# EAGLE schematic MO-v2-5_MOD-Strips (EAGLE 8.3.2)
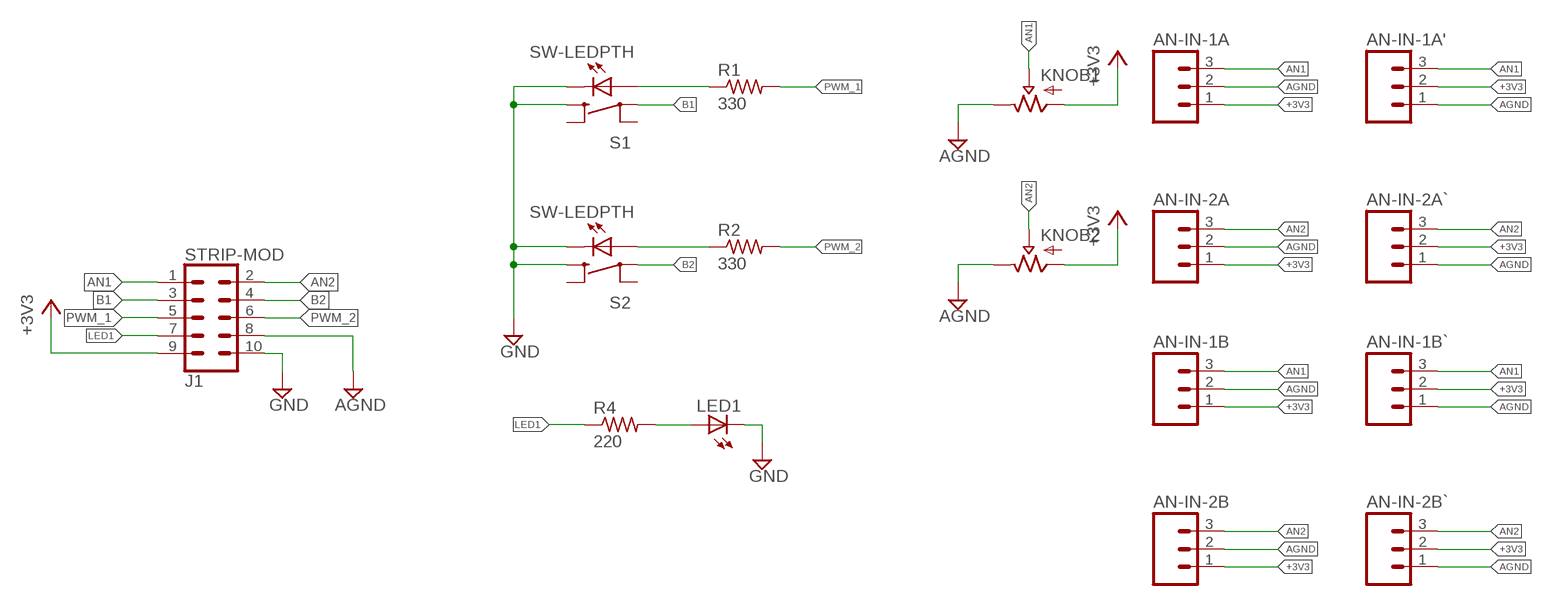
[diagram p0: schematic, sheet 1]

## Parts
AN-IN-1A  M031X03_NO_SILK  [1X03_NO_SILK]
AN-IN-1A'  M031X03_NO_SILK  [1X03_NO_SILK]
AN-IN-1B  M031X03_NO_SILK  [1X03_NO_SILK]
AN-IN-1B`  M031X03_NO_SILK  [1X03_NO_SILK]
AN-IN-2A  M031X03_NO_SILK  [1X03_NO_SILK]
AN-IN-2A`  M031X03_NO_SILK  [1X03_NO_SILK]
AN-IN-2B  M031X03_NO_SILK  [1X03_NO_SILK]
AN-IN-2B`  M031X03_NO_SILK  [1X03_NO_SILK]
KNOB1  POTALPHA_RD901  [POT_ALPHA_RD901F-40-(L)R1]
KNOB2  POTALPHA_RD901  [POT_ALPHA_RD901F-40-(L)R1]
LED1  LED3MM  [LED3MM]
R1  330  R-US_0204/7  [0204/7]
R2  330  R-US_0204/7  [0204/7]
R4  220  R-US_0204/7  [0204/7]
S1  SW-LEDPTH  [SWITCH_TR2-MOMENTARY-LED]
S2  SW-LEDPTH  [SWITCH_TR2-MOMENTARY-LED]
STRIP-MOD  J1  CONN_05X2SHD_LOCK  [2X5-SHROUDED_LOCK]

## Nets
+3V3: AN-IN-1A'.2 AN-IN-1A.1 AN-IN-1B.1 AN-IN-1B`.2 AN-IN-2A.1 AN-IN-2A`.2 AN-IN-2B.1 AN-IN-2B`.2 KNOB1.1(IN) KNOB2.1(IN) STRIP-MOD.9
AGND [Analog Sig]: AN-IN-1A'.1 AN-IN-1A.2 AN-IN-1B.2 AN-IN-1B`.1 AN-IN-2A.2 AN-IN-2A`.1 AN-IN-2B.2 AN-IN-2B`.1 KNOB1.3(OUT) KNOB2.3(OUT) STRIP-MOD.8
AN1 [Analog Sig]: AN-IN-1A'.3 AN-IN-1A.3 AN-IN-1B.3 AN-IN-1B`.3 KNOB1.2(WIPER) STRIP-MOD.1
AN2 [Analog Sig]: AN-IN-2A.3 AN-IN-2A`.3 AN-IN-2B.3 AN-IN-2B`.3 KNOB2.2(WIPER) STRIP-MOD.2
B1: S1.3 STRIP-MOD.3
B2: S2.3 STRIP-MOD.4
GND: LED1.K(C) S1.1 S1.C S2.1 S2.C STRIP-MOD.10
LED1: R4.1 STRIP-MOD.7
N1: LED1.A R4.2
N$1: R1.1 S1.A
N$2: R2.1 S2.A
PWM_1 [power]: R1.2 STRIP-MOD.5
PWM_2 [power]: R2.2 STRIP-MOD.6
Unconnected: S1.2 S1.4 S2.2 S2.4

## Library data of the parts
AN-IN-1A AN-IN-1A' AN-IN-1B AN-IN-1B` AN-IN-2A AN-IN-2A` AN-IN-2B AN-IN-2B` = SparkFun-Connectors:M03: Header 3 Standard 3-pin 0.1" header. Use with straight break away headers (SKU : PRT-00116), right angle break away headers (PRT-00553), swiss pins (PRT-00743), machine pins (PRT-00117), and female headers (PRT-00115). Molex polarized connector foot print use with SKU : PRT-08232 with associated crimp pins and housings.
KNOB1 KNOB2 = CMU-ArtFab:POT: http://www.taydaelectronics.com/10k-ohm-linear-taper-potentiometer-round-shaft-pcb-9mm.html http://www.taydaelectronics.com/datasheets/A-1847.pdf
LED1 = led:LED: LED OSRAM: - CHIPLED LG R971, LG N971, LY N971, LG Q971, LY Q971, LO R971, LY R971 LH N974, LH R974 LS Q976, LO Q976, LY Q976 LO Q996 - Hyper CHIPLED LW Q18S LB Q993, LB Q99A, LB R99A - SideLED LS A670, LO A670, LY A670, LG A670, LP A670 LB A673, LV A673, LT A673, LW A673 LH A674 LY A675 LS A676, LA A676, LO A676, LY A676, LW A676 LS A679, LY A679, LG A679 - Hyper Micro SIDELED® LS Y876, LA Y876, LO Y876, LY Y876 LT Y87S - SmartLED LW L88C, LW L88S LB L89C, LB L89S, LG L890 LS L89K, LO L89K, LY L89K LS L896, LA L896, LO L896, LY L896 - TOPLED LS T670, LO T670, LY T670, LG T670, LP T670 LSG T670, LSP T670, LSY T670, LOP T670, LYG T670 LG T671, LOG T671, LSG T671 LB T673, LV T673, LT T673, LW T673 LH T674 LS T676, LA T676, LO T676, LY T676, LB T676, LH T676, LSB T676, LW T676 LB T67C, LV T67C, LT T67C, LS T67K, LO T67K, LY T67K, LW E67C LS E67B, LA E67B, LO E67B, LY E67B, LB E67C, LV E67C, LT E67C LW T67C LS T679, LY T679, LG T679 LS T770, LO T770, LY T770, LG T770, LP T770 LB T773, LV T773, LT T773, LW T773 LH T774 LS E675, LA E675, LY E675, LS T675 LS T776, LA T776, LO T776, LY T776, LB T776 LHGB T686 LT T68C, LB T68C - Hyper Mini TOPLED® LB M676 - Mini TOPLED Santana® LG M470 LS M47K, LO M47K, LY M47K Source: http://www.osram.convergy.de LUXEON: - LUMILED® LXK2-PW12-R00, LXK2-PW12-S00, LXK2-PW14-U00, LXK2-PW14-V00 LXK2-PM12-R00, LXK2-PM12-S00, LXK2-PM14-U00 LXK2-PE12-Q00, LXK2-PE12-R00, LXK2-PE12-S00, LXK2-PE14-T00, LXK2-PE14-U00 LXK2-PB12-K00, LXK2-PB12-L00, LXK2-PB12-M00, LXK2-PB14-N00, LXK2-PB14-P00, LXK2-PB14-Q00 LXK2-PR12-L00, LXK2-PR12-M00, LXK2-PR14-Q00, LXK2-PR14-R00 LXK2-PD12-Q00, LXK2-PD12-R00, LXK2-PD12-S00 LXK2-PH12-R00, LXK2-PH12-S00 LXK2-PL12-P00, LXK2-PL12-Q00, LXK2-PL12-R00 Source: www.luxeon.com KINGBRIGHT: KA-3528ASYC Source: www.kingbright.com
R1 R2 R4 = CMU-ArtFab:R-US_: RESISTOR, American symbol
S1 S2 = CMU-ArtFab:SW-LED: SWITCH PUSH SPST-NO 10MA 12V
STRIP-MOD = SparkFun-Connectors:CONN_05X2: Multi connection point. Often used as Generic Header-pin footprint for 0.1 inch spaced/style header connections For AVR SPI programming port, see special device with nice symbol: "AVR_SPI_PROG_5x2.dev" You can populate with any combo of single row headers, but if you'd like an exact match, check these: 2x5 AVR ICSP Male Header <https://www.sparkfun.com/products/778> (PRT-00778) 2x5 Pin Shrouded Header <https://www.sparkfun.com/products/8506> (PRT-08506) On any of the 0.1 inch spaced packages, you can populate with these: Break Away Headers - Straight <https://www.sparkfun.com/products/116> (PRT-00116) Break Away Male Headers - Right Angle <https://www.sparkfun.com/products/553> (PRT-00553) Female Headers <https://www.sparkfun.com/products/115> (PRT-00115) Break Away Headers - Machine Pin <https://www.sparkfun.com/products/117> (PRT-00117) Break Away Female Headers - Swiss Machine Pin <https://www.sparkfun.com/products/743> (PRT-00743) Special note: the shrouded connector mates well with our 5x2 ribbon cables: 2x5 Pin IDC Ribbon Cable <https://www.sparkfun.com/products/8535> (PRT-08535); PROD_ID: CONN-08671; SF_ID: PRT-08506

## Net classes
0 default: width 0.203 mm, clearance 0.203 mm
1 power: width 0.61 mm, clearance 0.61 mm
3 Analog Sig: width 0.406 mm, clearance 0.406 mm